# Altium schematic sheet SoftCore_SA_P2_PG4.SchDoc: =ProjectTitle
size B; Engineer: Hab S Collector; Address1: 3621 Gin Way; Address2: Snellville GA, 30039; SheetNumber: 4; SheetTotal: 7
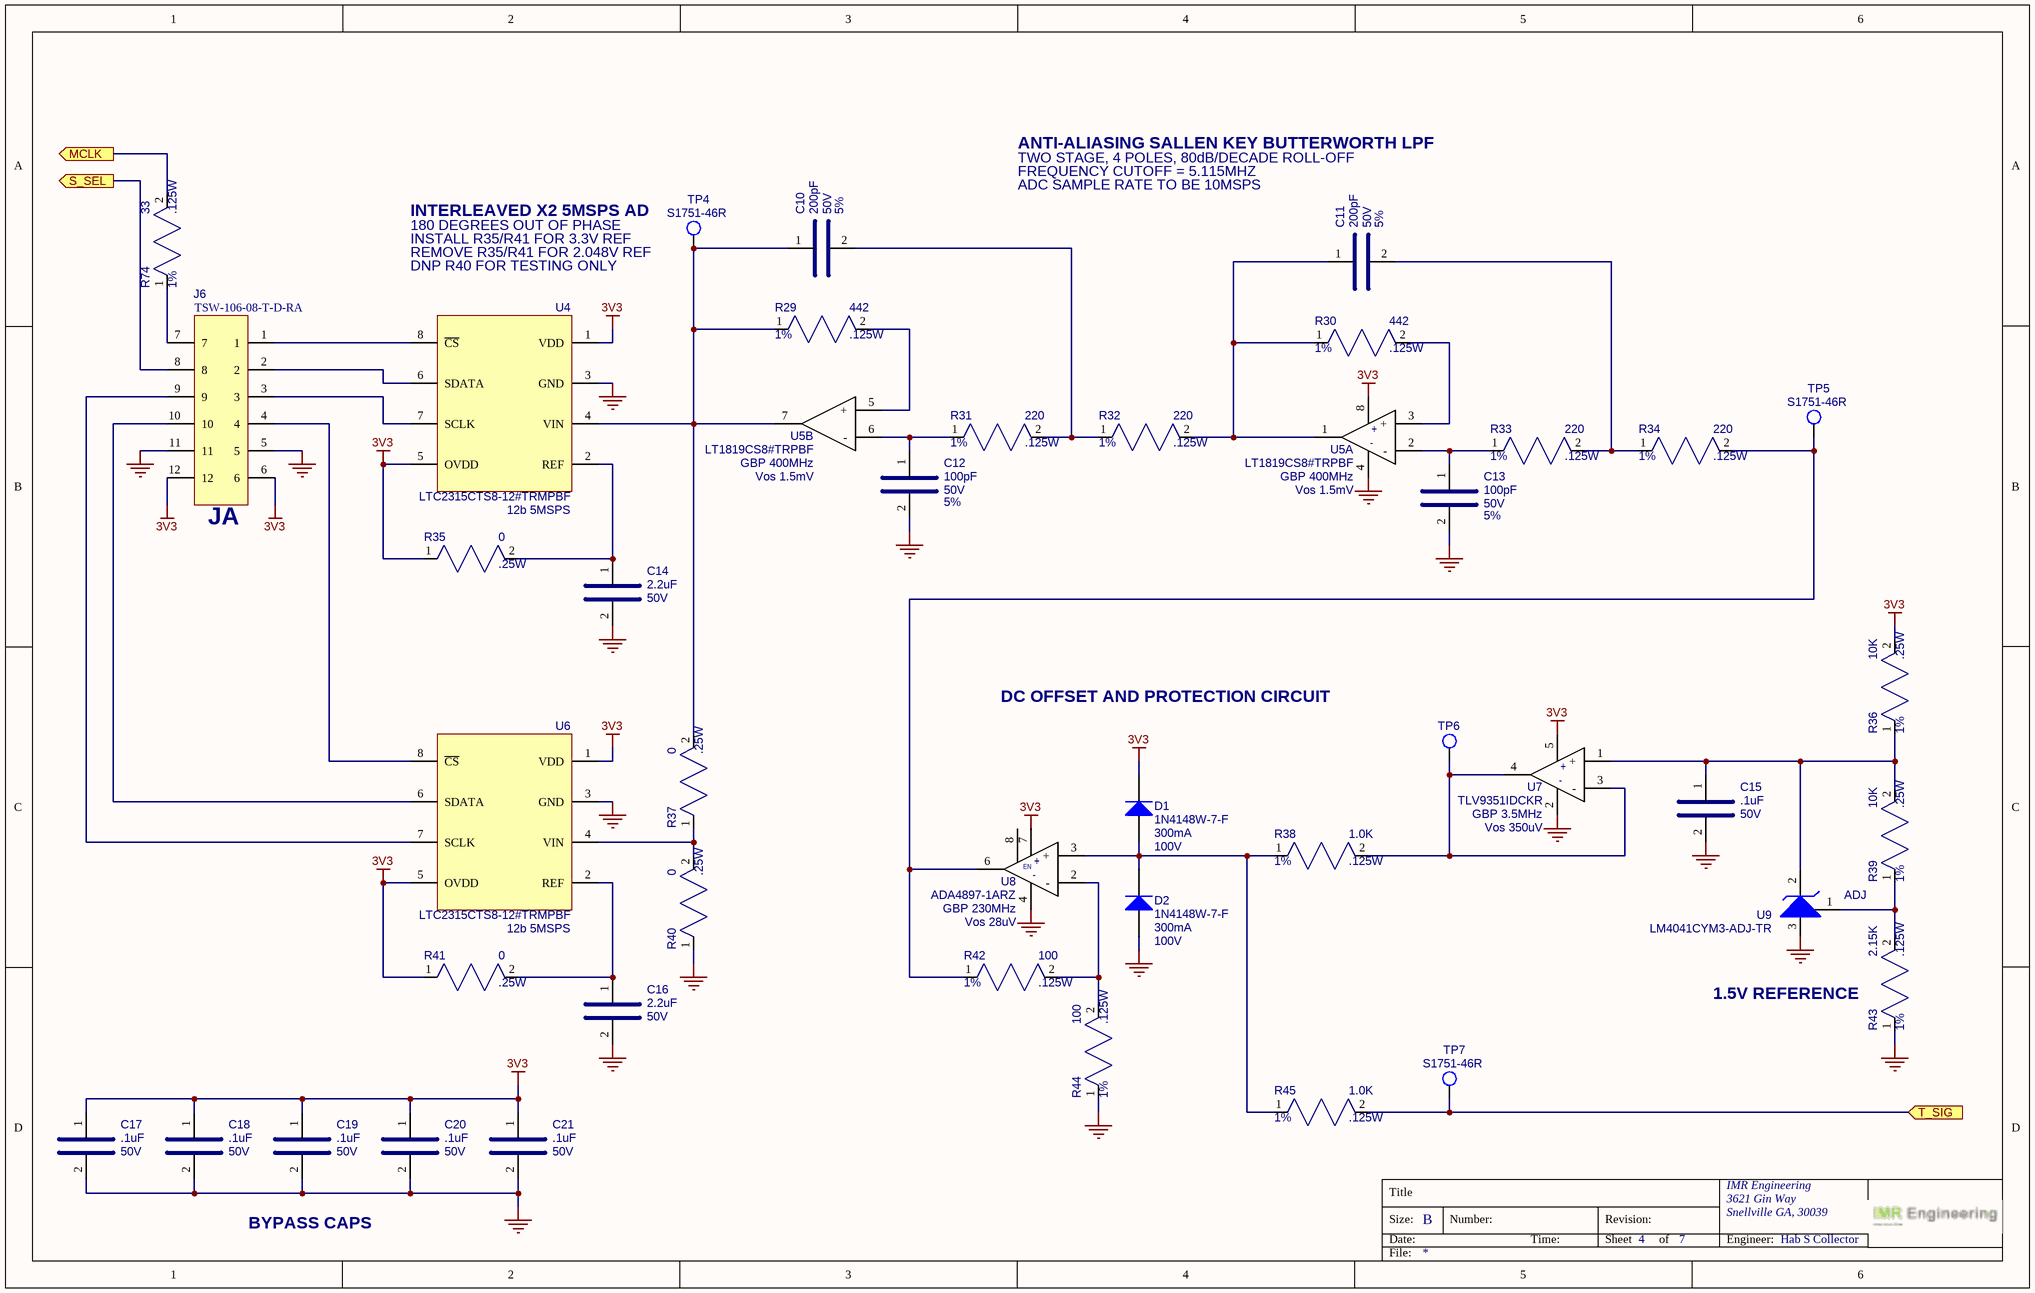
[diagram p0: SoftCore_SA_P2_PG4.SchDoc]

## Parts
C10  value 200pF  Voltage: 50V  Tolerance: 5%  [CAP_0805]  (hidden comment: C0805C201J5RACAUTO)
C11  value 200pF  Voltage: 50V  Tolerance: 5%  [CAP_0805]  (hidden comment: C0805C201J5RACAUTO)
C12  value 100pF  Voltage: 50V  Tolerance: 5%  [CAP_0805]  (hidden comment: C0805C101J5RACAUTO)
C13  value 100pF  Voltage: 50V  Tolerance: 5%  [CAP_0805]  (hidden comment: C0805C101J5RACAUTO)
C14  value 2.2uF  Voltage: 50V  [CAP_0805]  (hidden comment: GRM219R61E225KA12J)
C15  value .1uF  Voltage: 50V  [CAP_0805]  (hidden comment: KGM21NR71H104KT)
C16  value 2.2uF  Voltage: 50V  [CAP_0805]  (hidden comment: GRM219R61E225KA12J)
C17  value .1uF  Voltage: 50V  [CAP_0805]  (hidden comment: KGM21NR71H104KT)
C18  value .1uF  Voltage: 50V  [CAP_0805]  (hidden comment: KGM21NR71H104KT)
C19  value .1uF  Voltage: 50V  [CAP_0805]  (hidden comment: KGM21NR71H104KT)
C20  value .1uF  Voltage: 50V  [CAP_0805]  (hidden comment: KGM21NR71H104KT)
C21  value .1uF  Voltage: 50V  [CAP_0805]  (hidden comment: KGM21NR71H104KT)
D1  value 100V  Current: 300mA  [SOD123]  (hidden comment: 1N4148W-7-F)
D2  value 100V  Current: 300mA  [SOD123]  (hidden comment: 1N4148W-7-F)
J6  TSW-106-08-T-D-RA  [SAMTEC_TSW-106-08-T-D-RA]
R29  value 442  Power: .125W  Tolerance: 1%  [RES_0805]  (hidden comment: RC0805FR-07442RL)
R30  value 442  Power: .125W  Tolerance: 1%  [RES_0805]  (hidden comment: RC0805FR-07442RL)
R31  value 220  Power: .125W  Tolerance: 1%  [RES_0805]  (hidden comment: RC0805FR-07220RL)
R32  value 220  Power: .125W  Tolerance: 1%  [RES_0805]  (hidden comment: RC0805FR-07220RL)
R33  value 220  Power: .125W  Tolerance: 1%  [RES_0805]  (hidden comment: RC0805FR-07220RL)
R34  value 220  Power: .125W  Tolerance: 1%  [RES_0805]  (hidden comment: RC0805FR-07220RL)
R35  value 0  Power: .25W  [RES_0805]  (hidden comment: RC0805JR-070RL)
R36  value 10K  Power: .25W  Tolerance: 1%  [RES_0805]  (hidden comment: RC0805FR-7W10KL)
R37  value 0  Power: .25W  [RES_0805]  (hidden comment: RC0805JR-070RL)
R38  value 1.0K  Power: .125W  Tolerance: 1%  [RES_0805]  (hidden comment: RC0805FR-071KL)
R39  value 10K  Power: .25W  Tolerance: 1%  [RES_0805]  (hidden comment: RC0805FR-7W10KL)
R40  value 0  Power: .25W  [RES_0805]  (hidden comment: RC0805JR-070RL)
R41  value 0  Power: .25W  [RES_0805]  (hidden comment: RC0805JR-070RL)
R42  value 100  Power: .125W  Tolerance: 1%  [RES_0805]  (hidden comment: RC0805FR-07100RL)
R43  value 2.15K  Power: .125W  Tolerance: 1%  [RES_0805]  (hidden comment: RC0805FR-072K15L)
R44  value 100  Power: .125W  Tolerance: 1%  [RES_0805]  (hidden comment: RC0805FR-07100RL)
R45  value 1.0K  Power: .125W  Tolerance: 1%  [RES_0805]  (hidden comment: RC0805FR-071KL)
R74  value 33  Power: .125W  Tolerance: 1%  [RES_0805]  (hidden comment: 311-33.0CRCT-ND)
TP4  S1751-46R  [HARWIN_S1751]
TP5  S1751-46R  [HARWIN_S1751]
TP6  (no value)  [TEST_POINT_35MIL_TH]  (no BOM)
TP7  S1751-46R  [HARWIN_S1751]
U4  value 12b 5MSPS  [SOT65P280X100-8N]  (hidden comment: LTC2315CTS8-12#TRMPBF)
U5  value GBP 400MHz  Vos: Vos 1.5mV  [SO-8_S_LIT]  (hidden comment: LT1819CS8#TRPBF)  (parts A,B of 2)
U6  value 12b 5MSPS  [SOT65P280X100-8N]  (hidden comment: LTC2315CTS8-12#TRMPBF)
U7  value GBP 3.5MHz  Vos: Vos 350uV  [SOT-353]  (hidden comment: TLV9351IDCKR)
U8  value GBP 230MHz  Vos: Vos 28uV  [R_8_ADI]  (hidden comment: ADA4897-1ARZ)
U9  value ADJ  [SOT-23]  (hidden comment: LM4041CYM3-ADJ-TR)

## Ports
MCLK (out), S_SEL (out), T_SIG (in)

## Nets
3V3: C17.1 C18.1 C19.1 C20.1 C21.1 D1.2(K) J6.6 J6.12 R35.1 R36.2 R41.1 U4.1(VDD) U4.5(OVDD) U5.8 U6.1(VDD) U6.5(OVDD) U7.5 U8.7
GND: C12.2 C13.2 C14.2 C15.2 C16.2 C17.2 C18.2 C19.2 C20.2 C21.2 D2.1(A) J6.5 J6.11 R40.1 R43.1 R44.1 U4.3(GND) U5.4 U6.3(GND) U7.2 U8.4 U9.3(A)
MCLK: R74.2 ; port MCLK
S_SEL: J6.8 ; port S_SEL
T_SIG: R45.2 TP7.1 ; port T_SIG
NetC10_1: C10.1 R29.1 R37.2 TP4.1 U4.4(VIN) U5.7
NetC10_2: C10.2 R31.2 R32.1
NetC11_1: C11.1 R30.1 R32.2 U5.1
NetC11_2: C11.2 R33.2 R34.1
NetC12_1: C12.1 R31.1 U5.6(-)
NetC13_1: C13.1 R33.1 U5.2(-)
NetC14_1: C14.1 R35.2 U4.2(REF)
NetC15_1: C15.1 R36.1 R39.2 U7.1(+) U9.2(K)
NetC16_1: C16.1 R41.2 U6.2(REF)
NetD1_1: D1.1(A) D2.2(K) R38.1 R45.1 U8.3(+)
NetJ6_1: J6.1 U4.8(~{CS})
NetJ6_2: J6.2 U4.6(SDATA)
NetJ6_3: J6.3 U4.7(SCLK)
NetJ6_4: J6.4 U6.8(~{CS})
NetJ6_7: J6.7 R74.1
NetJ6_9: J6.9 U6.7(SCLK)
NetJ6_10: J6.10 U6.6(SDATA)
NetR29_2: R29.2 U5.5(+)
NetR30_2: R30.2 U5.3(+)
NetR34_2: R34.2 R42.1 TP5.1 U8.6
NetR37_1: R37.1 R40.2 U6.4(VIN)
NetR38_2: R38.2 TP6.1 U7.3(-) U7.4
NetR39_1: R39.1 R43.2 U9.1(FB)
NetR42_2: R42.2 R44.2 U8.2(-)

Not connected (* = marked no-connect by the designer): U8 8

## Notes on the sheet
- ANTI-ALIASING SALLEN KEY BUTTERWORTH LPF
- TWO STAGE, 4 POLES, 80dB/DECADE ROLL-OFF
- INTERLEAVED X2 5MSPS AD
- 180 DEGREES OUT OF PHASE
- FREQUENCY CUTOFF = 5.115MHZ
- ADC SAMPLE RATE TO BE 10MSPS
- INSTALL R35/R41 FOR 3.3V REF
- REMOVE R35/R41 FOR 2.048V REF
- DNP R40 FOR TESTING ONLY
- (near J6) JA
- DC OFFSET AND PROTECTION CIRCUIT
- 1.5V REFERENCE
- BYPASS CAPS
- Title
- Size:
- Date:
- B
- Number:
- Time:
- Revision:
- Sheet
- of
- IMR Engineering
- Engineer:
- File:
- (in symbol IC_OPAMP_ADA4897-1ARZ) EN

## Library data of the parts
C10 C11 = CAP_SMD_200PF_50V_0805: CAP CER 200PF 50V X7R 0805; MFG: KEMET; Case/Package: 0805; MFG_PN: C0805C201J5RACAUTO; Supplier 1: DigiKey; Supplier Part Number 1: 399-C0805C201J5RACAUTOCT-ND; Unit Price: .19
C12 C13 = CAP_SMD_100PF_50V_0805: CAP CER 100PF 50V X7R 0805; MFG: KEMET; Case/Package: 0805; MFG_PN: C0805C101J5RACAUTO; Supplier 1: DigiKey; Supplier Part Number 1: 399-17614-1-ND; Unit Price: .17
C14 C16 = CAP_SMD_2.2UF_50V_0805: CAP CER 2.2UF 50V X5R 0805; MFG: Murata Electronics; Case/Package: 0805; MFG_PN: GRM219R61E225KA12J; Supplier 1: DigiKey; Supplier Part Number 1: 490-GRM219R61E225KA12JCT-ND; Unit Price: .38
C15 C17-C21 = CAP_SMD_0.1UF_50V_0805: CAP CER 0.1UF 50V X7R 0805; MFG: KYOCERA AVX; Case/Package: 0805; MFG_PN: KGM21NR71H104KT; Supplier 1: DigiKey; Supplier Part Number 1: 478-KGM21NR71H104KTCT-ND; Unit Price: .1
D1 D2 = DIODE_1N4148W-7-F: RELAY REED SPDT 250MA 5V; MFG: Diodes Inc; Case/Package: SOD-123; Supplier 1: DigiKey; Supplier Part Number 1: 1N4148W-FDICT-ND; Unit Price: .16; MFG_PN: 1N4148W-7-F
J6 = CONN_HEADER_12P_100MIL_RA: CONN HEADER R/A 12POS 2.54MM; MFG: Samtec Inc.; Case/Package: 2P_2.54MM; Supplier 1: Digi-Key; Supplier Part Number 1: SAM1049-06-ND; Unit Price: .93; MFG_PN: TSW-106-08-T-D-RA
R29 R30 = RES_SMD_442_0805_1/8W_1%: RES SMD 442 OHM 1% 1/8W 0805; MFG: Yageo; Case/Package: 0805; MFG_PN: RC0805FR-07442RL; Supplier 1: DigiKey; Supplier Part Number 1: 311-442CRCT-ND; Unit Price: .1
R31-R34 = RES_SMD_220_0805_1/8W_1%: RES SMD 220 OHM 1% 1/8W 0805; MFG: Yageo; Case/Package: 0805; MFG_PN: RC0805FR-07220RL; Supplier 1: DigiKey; Supplier Part Number 1: 311-220CRCT-ND; Unit Price: .1
R35 R37 R40 R41 = RES_SMD_0_0805_1/8W_1%: RES SMD 0 OHM 1% 1/8W 0805; MFG: Yageo; Case/Package: 0805; MFG_PN: RC0805JR-070RL; Supplier 1: DigiKey; Supplier Part Number 1: 311-0.0ARCT-ND; Unit Price: .1; Tolerance: 1%
R36 R39 = RES_SMD_10K_0805_1/4W_1%: RES SMD 10K OHM 1% 1/4W 0805; MFG: Yageo; Case/Package: 0805; MFG_PN: RC0805FR-7W10KL; Supplier 1: DigiKey; Supplier Part Number 1: 13-RC0805FR-7W10KLCT-ND; Unit Price: .10
R38 R45 = RES_SMD_1.0K_0805_1/8W_1%: RES SMD 1.0K OHM 1% 1/8W 0805; MFG: Yageo; Case/Package: 0805; MFG_PN: RC0805FR-071KL; Supplier 1: DigiKey; Supplier Part Number 1: 311-1.00KCRCT-ND; Unit Price: .1
R42 R44 = RES_SMD_100_0805_1/8W_1%: RES SMD 100 OHM 1% 1/8W 0805; MFG: Yageo; Case/Package: 0805; MFG_PN: RC0805FR-07100RL; Supplier 1: DigiKey; Supplier Part Number 1: 311-100CRCT-ND; Unit Price: .1
R43 = RES_SMD_2.15K_0805_1/8W_1%: RES SMD 2.15K OHM 1% 1/8W 0805; MFG: Yageo; Case/Package: 0805; MFG_PN: RC0805FR-072K15L; Supplier 1: DigiKey; Supplier Part Number 1: 311-2.15KCRCT-ND; Unit Price: .1
R74 = RES_SMD_33_0805_1/8W_1%: RES SMD 33K OHM 1% 1/8W 0805; MFG: Yageo; Case/Package: 0805; MFG_PN: 311-33.0CRCT-ND; Supplier 1: DigiKey; Supplier Part Number 1: 311-33.0CRCT-ND; Unit Price: .1
TP4 TP5 TP7 = CONN_TEST_POINT_S1751-46R: PCB TEST POINT CONNECT; MFG: Harwin Inc; Case/Package: S1751; Supplier 1: Digi-Key; Supplier Part Number 1: 952-1478-1-ND; Value: *; Unit Price: .28; MFG_PN: S1751-46R
TP6 = CONN_TEST_POINT_TH_PROBE_TIP: TEST POINT TH FITS DSO PROBE TIP
U4 U6 = IC_LTC2315CTS8-12#TRMPBF: IC ADC 12BIT SAR TSOT23-8; MFG: Analog Devices; Case/Package: SOT-23-6; Supplier 1: DigiKey; Supplier Part Number 1: LTC2315CTS8-12#TRMPBFCT-ND; Unit Price: 15.34; MFG_PN: LTC2315CTS8-12#TRMPBF
U5 = IC_OPAMP_LT1819CS8#TRPBF: IC OPAMP GBP 400MHz CIRCUIT 8SOIC; MFG: Analog Devices; Unit Price: 5.94; Package/Case: SOIC-8; Supplier 1: DigiKey; Supplier Part Number 1: LT1819CS8#TRPBFCT-ND; MFG_PN: LT1819CS8#TRPBF
U7 = IC_OPAMP_TLV9351IDCKR: IC OPAMP GP 3.5MHZ 350uV C70-5; MFG: Texas Instruments; Unit Price: .49; Package/Case: SOT-353; Supplier 1: DigiKey; Supplier Part Number 1: 296-TLV9351IDCKRCT-ND; MFG_PN: TLV9351IDCKR
U8 = IC_OPAMP_ADA4897-1ARZ: IC OPAMP GP 230MHZ 28uV 8SOIC; MFG: Analog Devices; Unit Price: 6.30; Package/Case: 8-SOIC; Supplier 1: DigiKey; Supplier Part Number 1: 505-ADA4897-1ARZ-ND; MFG_PN: ADA4897-1ARZ
U9 = IC_LM4041CYM3-ADJ-TR: IC VREF SHUNT ADJ 0.5% SOT23-3; MFG: Microchip; Case/Package: SOT-23; Supplier 1: DigiKey; Supplier Part Number 1: 576-1049-1-ND; Unit Price: .39; MFG_PN: LM4041CYM3-ADJ-TR